# EAGLE design 808_noise (EAGLE 7.1.0)
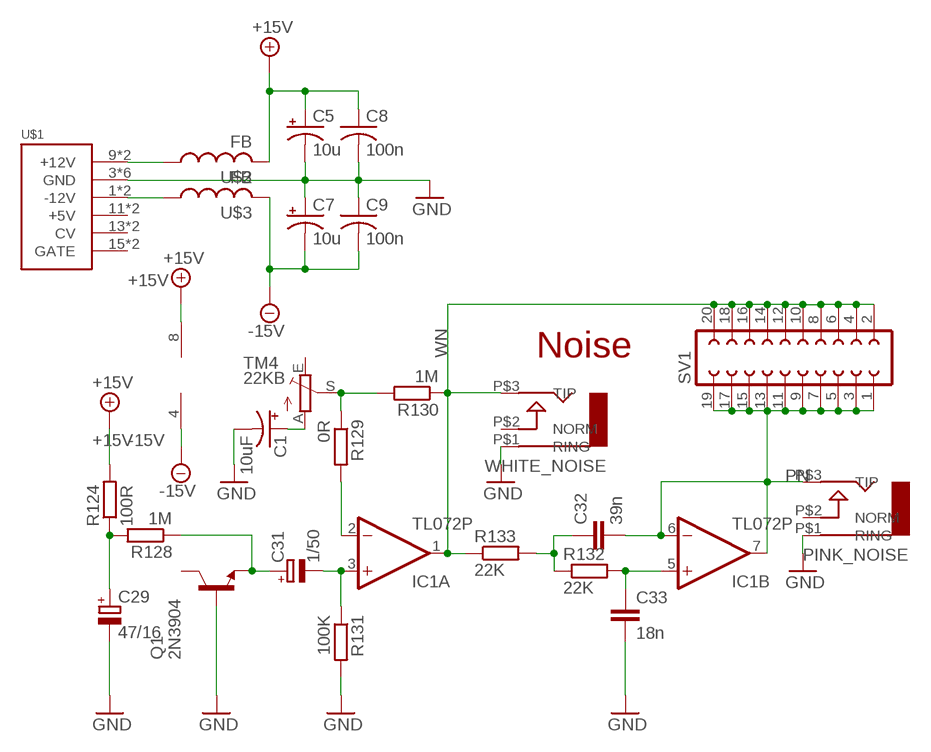
[diagram p0: schematic, sheet 1]

## Parts
C1  10uF  CPOL-USB45181A  [B45181A]
C5  10u  CPOL-USB45181A  [B45181A]
C7  10u  CPOL-USB45181A  [B45181A]
C8  100n  C-US050-024X044  [C050-024X044]
C9  100n  C-US050-024X044  [C050-024X044]
C29  47/16  CPOL-EUE2.5-5  [E2,5-5]
C31  1/50  CPOL-EUE2.5-5  [E2,5-5]
C32  39n  C-EU050-024X044  [C050-024X044]
C33  18n  C-EU4MM_PITCH  [C035-030X60]
IC1  TL072P  [DIL08]
PINK_NOISE  AUDIO-JACK  [ERTHENVAR-JACK-90DEG]
Q1  2N3904  [TO92]
R124  100R  R-EU_0207/7  [0207/7]
R128  1M  R-EU_0207/7  [0207/7]
R129  0R  R-EU_0207/7  [0207/7]
R130  1M  R-EU_0207/7  [0207/7]
R131  100K  R-EU_0207/7  [0207/7]
R132  22K  R-EU_0207/7  [0207/7]
R133  22K  R-EU_0207/7  [0207/7]
SV1  FE10-2  [FE10-2]
TM4  22KB  TRIM_EU-B64Y  [B64Y]
U$1  POWER  [POWER_16]
U$2  FB  [FB]
U$3  FB  [FB]
WHITE_NOISE  AUDIO-JACK  [ERTHENVAR-JACK-90DEG]

## Nets
+15V [Power]: C5.+ C8.1 IC1.8(P:V+) R124.2 U$2.P$2
-15V [Power]: C7.- C9.2 IC1.4(P:V-) U$3.P$2
GND [GND]: C1.- C5.- C7.+ C8.2 C9.1 C29.- C33.P$2 PINK_NOISE.P$1(RING) Q1.2(B) R131.2 U$1.3(GND) U$1.4(GND) U$1.5(GND) U$1.6(GND) U$1.7(GND) U$1.8(GND) WHITE_NOISE.P$1(RING)
N$1: C1.+ TM4.A
N$2: IC1.2(A:-IN) R129.2
N$11: U$1.9(+12V) U$1.10(+12V) U$2.P$1
N$18: U$1.1(-12V) U$1.2(-12V) U$3.P$1
N$280: C31.- IC1.3(A:+IN) R131.1
N$490: R129.1 R130.2 TM4.S
N$491: C31.+ Q1.3(E) R128.1
N$492: C29.+ R124.1 R128.2
N$493: C32.1 R132.1 R133.2
N$494: C33.P$1 IC1.5(B:+IN) R132.2
PN: C32.2 IC1.6(B:-IN) IC1.7(B:OUT) PINK_NOISE.P$3(TIP) SV1.1 SV1.3 SV1.5 SV1.7 SV1.9 SV1.11 SV1.13 SV1.15 SV1.17 SV1.19
WN: IC1.1(A:OUT) R130.1 R133.1 SV1.2 SV1.4 SV1.6 SV1.8 SV1.10 SV1.12 SV1.14 SV1.16 SV1.18 SV1.20 WHITE_NOISE.P$3(TIP)
Unconnected: PINK_NOISE.P$2(NORM) Q1.1(C) TM4.E U$1.11(+5V) U$1.12(+5V) U$1.13(CV) U$1.14(CV) U$1.15(GATE) U$1.16(GATE) WHITE_NOISE.P$2(NORM)

## Notes on the sheet
- Noise

## Library data of the parts
C1 C5 C7 = rcl:CPOL-US: POLARIZED CAPACITOR, American symbol
C8 C9 = rcl:C-US: CAPACITOR, American symbol
C29 C31 = TR808clone:CPOL-EU: POLARIZED CAPACITOR, European symbol
C32 C33 = TR808clone:C-EU: CAPACITOR, European symbol Pitch 3mm
IC1 = linear:TL072: OP AMP
PINK_NOISE WHITE_NOISE = erthenvar:AUDIO-JACK: Switching Mono 3.5mm Audio Jack from Erthenvar.
Q1 = transistor-npn:2N3904: NPN Transistor
R124 R128-R133 = TR808clone:R-EU_: RESISTOR, European symbol
SV1 = con-lsta:FE10-2: FEMALE HEADER; OC_FARNELL: unknown; OC_NEWARK: unknown
TM4 = TR808clone:TRIM_EU-: POTENTIOMETER
U$1 = eurorack:POWER
U$2 U$3 = adafruit:FB: Ferrite bead Digikey #P9821BK-ND

## Net classes
0 default: width 0.635 mm, drill 0.254 mm, clearance 0.254 mm
1 GND: width 1.016 mm, drill 1.016 mm, clearance 0.508 mm
2 Power: width 1.016 mm, drill 1.016 mm, clearance 0.508 mm

## Board
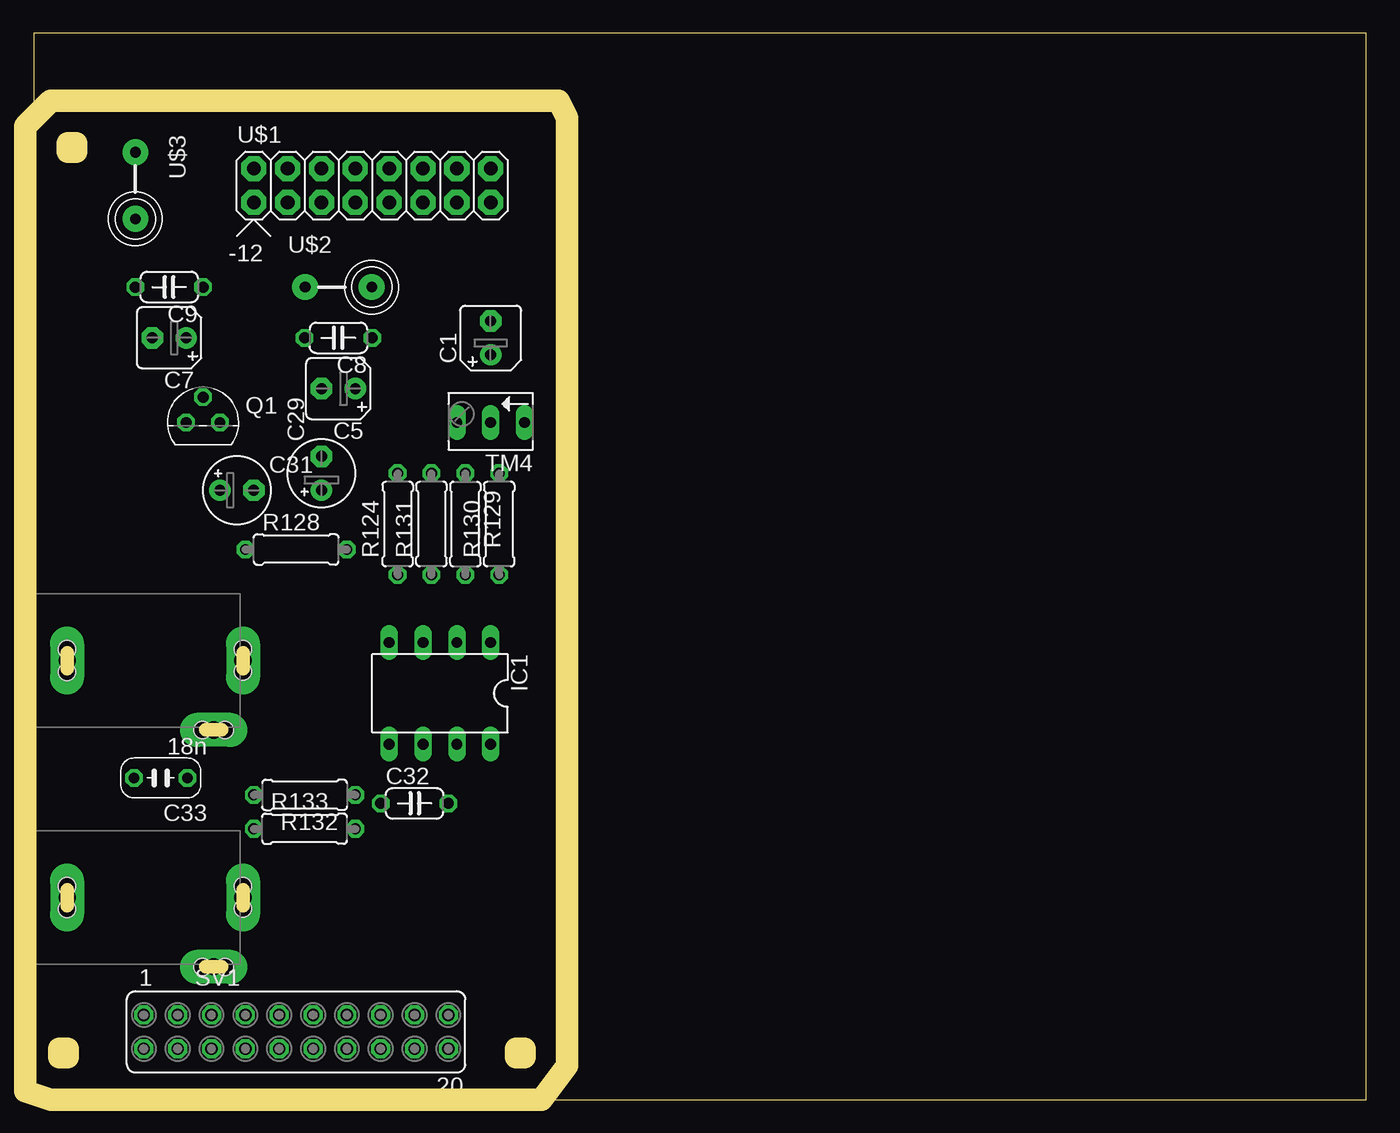
[diagram p1: board, top side]
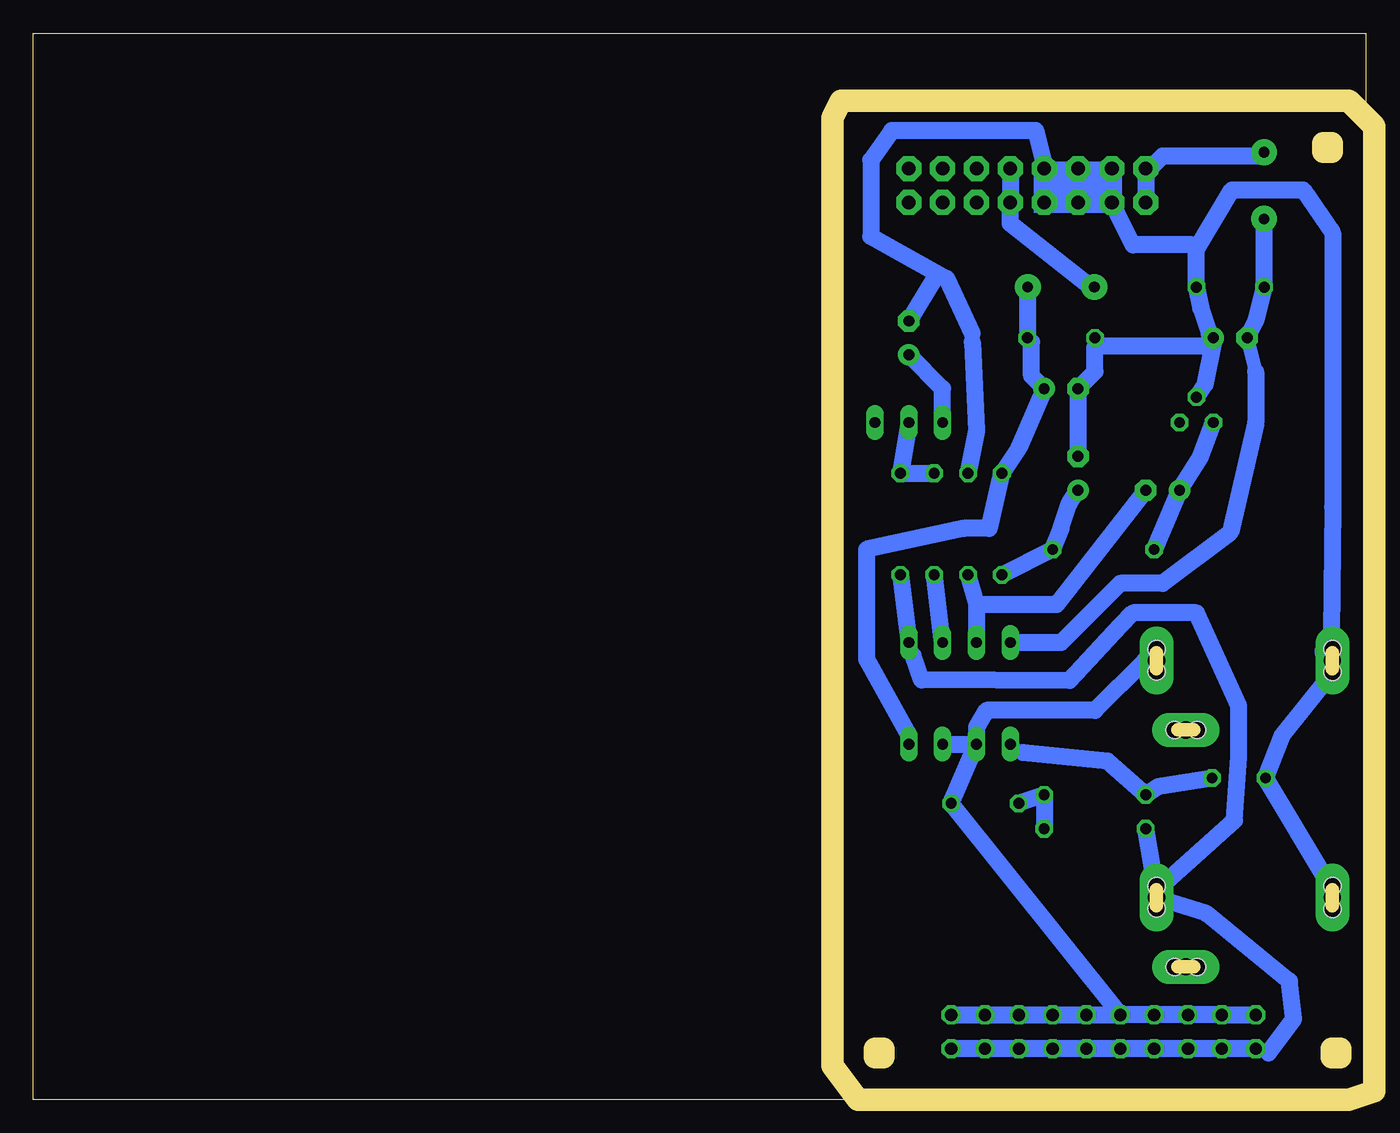
[diagram p2: board, bottom side, seen from below]

Size 100 x 80 mm. Coordinates in mm from the lower left corner, seen from the top.
Outline: 0,0 100,0 100,80 0,80 0,0
Copper layers (1*16): Top 0.035mm / dielectric 1.5mm / Bottom 0.035mm
Design rules "default *": minimum track width 32mil, minimum drill 31mil, track to track 18mil, track to pad 18mil, pad to pad 18mil, via to via 18mil, smd to smd 8mil, copper to edge 0mil, drill to drill 18mil, minimum pad ring 10mil, minimum via ring 8mil, stop-mask expansion 4mil, vias tented up to drill 0mil, thermal gap 10mil
Milling: 20 lines

### Footprints (pad centres in the part's own frame; a part is rotated, then mirrored left to right if it is on the bottom)
B45181A = drill 0.813 pad 1.6: + -1.27,0 | drill 0.813 pad 1.6 octagon: - 1.27,0
C050-024X044 = drill 0.813 octagon: 1 -2.54,0; 2 2.54,0
E2,5-5 = drill 0.813 pad 1.6: + -1.27,0 | drill 0.813 pad 1.6 octagon: - 1.27,0
C035-030X60 = drill 0.8 octagon: P$1 -2,0; P$2 2,0
DIL08 = drill 0.813 long: 1 -3.81,-3.81; 2 -1.27,-3.81; 3 1.27,-3.81; 4 3.81,-3.81; 5 3.81,3.81; 6 1.27,3.81; 7 -1.27,3.81; 8 -3.81,3.81
ERTHENVAR-JACK-90DEG = drill 1.3 pad 2.54 long: P$1 5,-2.5; P$2 -0.2,-13.5; P$3 5,-15.7 | hole 1.3: 5.842,-2.489; 4.14,-2.489; -0.203,-12.649; -0.203,-14.351; 5.842,-15.697; 4.166,-15.697
TO92 = drill 0.813 octagon: 1 1.27,0; 2 0,1.905; 3 -1.27,0
0207/7 = drill 0.813 octagon: 1 -3.81,0; 2 3.81,0
FE10-2 = drill 0.914 octagon: 1 -11.43,1.27; 2 -11.43,-1.27; 3 -8.89,1.27; 4 -8.89,-1.27; 5 -6.35,1.27; 6 -6.35,-1.27; 7 -3.81,1.27; 8 -3.81,-1.27; 9 -1.27,1.27; 10 -1.27,-1.27; 11 1.27,1.27; 12 1.27,-1.27; 13 3.81,1.27; 14 3.81,-1.27; 15 6.35,1.27; 16 6.35,-1.27; 17 8.89,1.27; 18 8.89,-1.27; 19 11.43,1.27; 20 11.43,-1.27
B64Y = drill 0.813 long: A 2.54,0; E -2.54,0; S 0,0
POWER_16 = drill 1.016 pad 1.88 octagon: 1 -6.35,-1.27; 2 -6.35,1.27; 3 -3.81,-1.27; 4 -3.81,1.27; 5 -1.27,-1.27; 6 -1.27,1.27; 7 1.27,-1.27; 8 1.27,1.27; 9 3.81,-1.27; 10 3.81,1.27; 11 6.35,-1.27; 12 6.35,1.27; 13 8.89,-1.27; 14 8.89,1.27; 15 11.43,-1.27; 16 11.43,1.27
FB = drill 0.8 pad 1.93: P$1 -2.5,0; P$2 2.5,0

### Placement (x,y rotation side)
C1  34.29,57.15 90 top
C5  22.86,53.34 180 top
C7  10.16,57.15 180 top
C8  22.86,57.15 180 top
C9  10.16,60.96 180 top
C29  21.59,46.99 90 top
C31  15.24,45.72 0 top
C32  28.57,22.23 0 top
C33  9.53,24.13 180 top
IC1  30.48,30.48 180 top
PINK_NOISE  0,27.94 90 top
Q1  12.7,50.8 0 top
R124  27.3,43.18 90 top
R128  19.68,41.27 0 top
R129  32.38,43.18 270 top
R130  34.92,43.18 90 top
R131  29.84,43.18 90 top
R132  20.32,22.86 180 top
R133  20.32,20.32 0 top
SV1  19.68,5.08 0 top
TM4  34.29,50.8 180 top
U$1  22.86,68.58 0 top
U$2  22.86,60.96 0 top
U$3  7.62,68.58 270 top
WHITE_NOISE  0,10.16 90 top

### Tracks (layer width: path | path; a pad name or v marks a point on that pad's centre or on a via)
+15V
  Bottom 1.016: 25.4,60.96 U$2.P$2 | 34.29,27.3 IC1.8 | 25.08,56.83 C8.1
  Bottom 1.27: 25.4,60.96 C8.1 | 34.29,27.3 37.47,33.02 37.47,41.27 30.16,42.86 28.26,42.86 R124.2 26.04,48.9 C5.+ 25.08,54.29 25.08,56.83
-15V
  Bottom 1.016: C7.- 8.26,54.61
  Bottom 1.27: C7.- 8.26,58.42 C9.2 U$3.P$2 | IC1.4 22.86,34.29 18.41,38.73 15.24,38.73 10.16,42.55 8.26,50.8 8.26,54.61
GND
  Bottom 0.813: 3.21,33.66 PINK_NOISE.P$1 | WHITE_NOISE.P$1 2.75,16.18
  Bottom 1.016: 20.32,56.52 C8.2 | C7.+ 11.43,56.83 | 11.75,56.52 C7.+ | U$1.4 U$1.6 U$1.8 24.13,70.17 | U$1.7 U$1.5 U$1.3 18.73,66.99 18.73,66.67 | 11.75,57.47 C7.+ | 29.53,57.47 29.53,56.83 | 31.43,61.59 32.38,61.59
  Bottom 1.27: C29.- C5.- 20.32,54.61 20.32,56.52 11.75,56.52 | Q1.2 12.06,53.66 11.43,56.83 | R131.2 29.21,50.16 29.53,56.83 | U$1.4 U$1.3 | 2.6,31.88 6.29,27.3 C33.P$2 2.75,16.18 | 2.6,31.88 2.48,44.45 2.48,65.02 4.7,68.26 10.03,68.26 12.7,63.82 | 12.7,63.82 C9.1 12.38,59.37 11.75,57.47 | 18.73,66.67 17.46,64.14 13.02,64.14 12.7,63.82 | 29.53,57.47 31.43,61.59 37.15,64.77 37.15,70.48 35.56,72.71 24.77,72.71 24.13,70.17 | 2.6,31.88 3.21,33.66 | 32.38,61.59 C1.-
N$1
  Bottom 1.27: TM4.A 31.75,53.34 C1.+
N$2
  Bottom 1.27: IC1.2 R129.2
N$11
  Bottom 0.813: 20.64,60.96 U$2.P$1
  Bottom 1.27: U$1.10 U$1.9 26.67,65.72 20.64,60.96
N$18
  Bottom 0.813: 7.62,70.8 U$3.P$1 | 16.19,69.85 U$1.2
  Bottom 1.27: U$1.2 U$1.1 | 7.62,70.8 15.24,70.8 16.19,69.85
N$280
  Bottom 1.27: R131.1 29.21,37.15 | 29.21,37.15 IC1.3 | C31.- 23.18,37.15 29.21,37.15
N$490
  Bottom 1.27: R129.1 R130.2 TM4.S
N$491
  Bottom 1.27: R128.1 C31.+ 12.38,48.26 Q1.3
N$492
  Bottom 1.27: R124.1 R128.2 22.86,42.86 22.23,44.77 C29.+
N$493
  Bottom 1.27: R133.2 R132.1 C32.1
N$494
  Bottom 0.813: 25.72,26.04 IC1.5
  Bottom 1.27: C33.P$1 15.56,23.5 R132.2 19.37,25.4 25.72,26.04
PN
  Bottom 0.813: SV1.9 SV1.11 SV1.13 SV1.15 SV1.17 SV1.19 | PINK_NOISE.P$3 16.59,32.94
  Bottom 1.27: SV1.1 SV1.3 SV1.5 SV1.7 SV1.9 | IC1.7 IC1.6 | SV1.9 C32.2 IC1.6 | SV1.19 SV1.9 | 16.59,32.94 20.32,29.21 28.45,29.21 29.21,27.94 IC1.6
WN
  Bottom 0.813: SV1.2 7.3,3.49 | 33.97,33.34 IC1.1 | 15.72,15.72 15.08,16.41 WHITE_NOISE.P$3
  Bottom 1.27: R133.1 15.72,15.72 9.84,20.95 9.53,25.72 9.53,29.53 12.7,36.51 17.46,36.51 18.41,35.56 22.23,31.43 33.34,31.5 33.97,33.34 | 7.3,3.49 5.4,6.03 5.71,8.89 11.97,13.97 WHITE_NOISE.P$3 | SV1.2 SV1.4 SV1.6 SV1.8 SV1.10 SV1.12 SV1.14 SV1.16 SV1.18 SV1.20 | R130.1 IC1.1
(copper drawn outside any net)
  shapes: Bottom area x1